# EAGLE schematic POWER-12V (EAGLE 9.4.0)
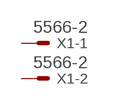
[diagram p0: schematic, sheet 1]

## Parts
X1  5566-2  [5566-2]
Unconnected: X1.1 X1.2

## Library data of the parts
X1 = con-molex:5566-2: Mini FIT connector 2 pol Source: http://www.molex.com; MF: MOLEX; OC_FARNELL: 1822072; OC_NEWARK: unknown